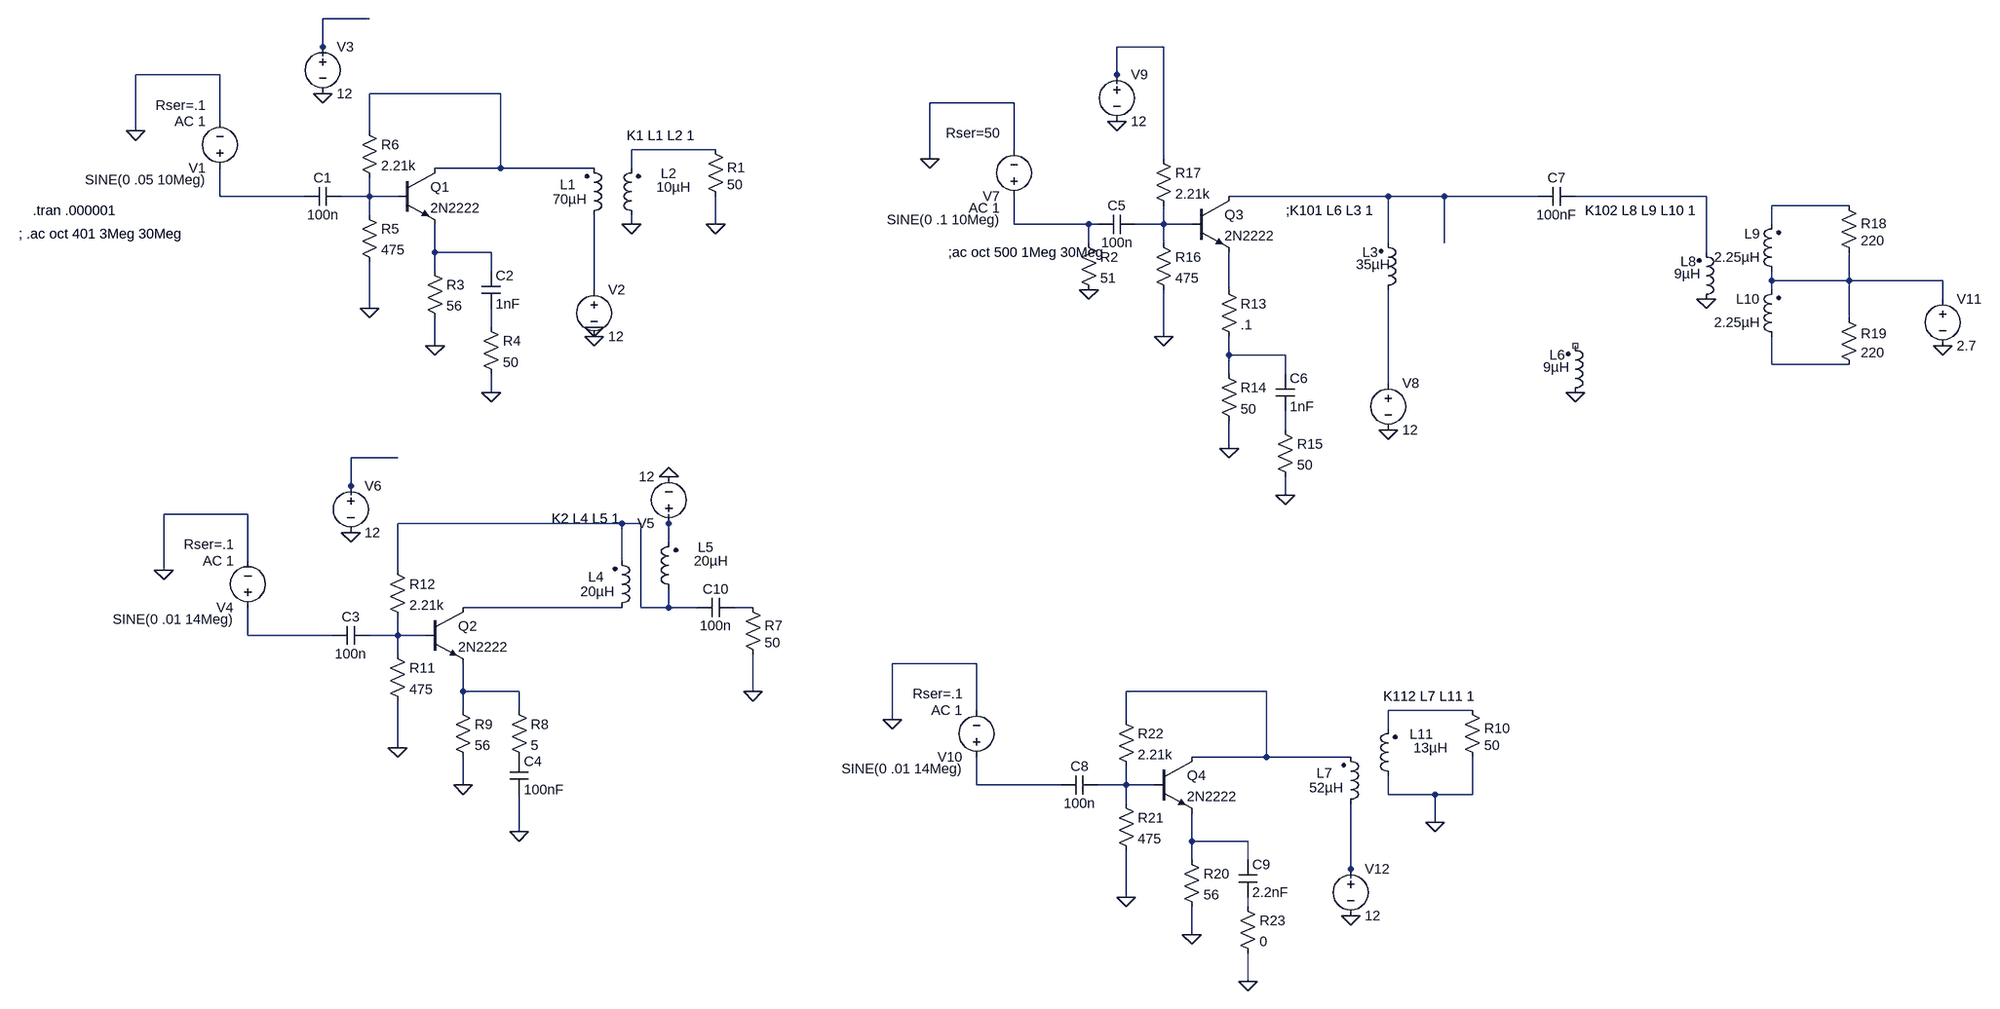
[diagram p0: schematic Tayloe-mix-amp.asc]
Tayloe-mix-amp.asc, the LTspice schematic file:
Version 4
SHEET 1 2732 1568
WIRE -112 -96 -192 -96
WIRE -192 -48 -192 -96
WIRE 1328 -48 1248 -48
WIRE -192 -32 -192 -48
WIRE -368 0 -512 0
WIRE 1248 0 1248 -48
WIRE 1248 16 1248 0
WIRE 112 32 -112 32
WIRE 1072 48 928 48
WIRE -368 80 -368 0
WIRE -512 96 -512 0
WIRE -112 96 -112 32
WIRE 480 128 336 128
WIRE 1072 128 1072 48
WIRE 928 144 928 48
WIRE 1328 144 1328 -48
WIRE 112 160 112 32
WIRE 112 160 0 160
WIRE 272 160 112 160
WIRE 336 160 336 128
WIRE -368 208 -368 160
WIRE -224 208 -368 208
WIRE -112 208 -112 176
WIRE -112 208 -160 208
WIRE -64 208 -112 208
WIRE 1712 208 1440 208
WIRE 1808 208 1712 208
WIRE 1968 208 1808 208
WIRE 2256 208 2032 208
WIRE 2512 224 2368 224
WIRE -112 240 -112 208
WIRE 336 256 336 240
WIRE 480 256 480 208
WIRE 1072 256 1072 208
WIRE 1200 256 1072 256
WIRE 1216 256 1200 256
WIRE 1328 256 1328 224
WIRE 1328 256 1280 256
WIRE 1376 256 1328 256
WIRE 2368 256 2368 224
WIRE 1200 288 1200 256
WIRE 1328 288 1328 256
WIRE 1712 288 1712 208
WIRE 1808 288 1808 208
WIRE 0 304 0 256
WIRE 96 304 0 304
WIRE 2256 304 2256 208
WIRE 0 336 0 304
WIRE 96 336 96 304
WIRE 2368 352 2368 336
WIRE 2512 352 2512 304
WIRE 2512 352 2368 352
WIRE 2672 352 2512 352
WIRE 272 368 272 240
WIRE 1440 368 1440 304
WIRE 2368 368 2368 352
WIRE 2672 384 2672 352
WIRE -112 400 -112 320
WIRE 2512 416 2512 352
WIRE 96 432 96 400
WIRE 1328 448 1328 368
WIRE 0 464 0 416
WIRE 1440 480 1440 448
WIRE 1536 480 1440 480
WIRE 2368 496 2368 448
WIRE 2512 496 2368 496
WIRE 1440 512 1440 480
WIRE 1536 512 1536 480
WIRE 1712 528 1712 368
WIRE 96 544 96 512
WIRE 1536 608 1536 576
WIRE 1440 640 1440 592
WIRE -64 656 -144 656
WIRE -144 704 -144 656
WIRE -144 720 -144 704
WIRE 1536 720 1536 688
WIRE -320 752 -464 752
WIRE 320 768 -64 768
WIRE 352 768 320 768
WIRE 400 768 400 752
WIRE 400 800 400 768
WIRE -320 832 -320 752
WIRE 320 832 320 768
WIRE -464 848 -464 752
WIRE -64 848 -64 768
WIRE 320 912 48 912
WIRE 352 912 352 768
WIRE 400 912 400 880
WIRE 400 912 352 912
WIRE 448 912 400 912
WIRE 544 912 512 912
WIRE -320 960 -320 912
WIRE -176 960 -320 960
WIRE -64 960 -64 928
WIRE -64 960 -112 960
WIRE -16 960 -64 960
WIRE -64 992 -64 960
WIRE 1008 1008 864 1008
WIRE 48 1056 48 1008
WIRE 144 1056 48 1056
WIRE 544 1056 544 992
WIRE 1504 1056 1264 1056
WIRE 48 1088 48 1056
WIRE 144 1088 144 1056
WIRE 1008 1088 1008 1008
WIRE 1856 1088 1712 1088
WIRE 864 1104 864 1008
WIRE 1264 1104 1264 1056
WIRE 1712 1120 1712 1088
WIRE -64 1152 -64 1072
WIRE 1504 1168 1504 1056
WIRE 1504 1168 1376 1168
WIRE 1648 1168 1504 1168
WIRE 48 1216 48 1168
WIRE 1008 1216 1008 1168
WIRE 1152 1216 1008 1216
WIRE 1264 1216 1264 1184
WIRE 1264 1216 1216 1216
WIRE 1312 1216 1264 1216
WIRE 1712 1232 1712 1200
WIRE 1792 1232 1712 1232
WIRE 1856 1232 1856 1168
WIRE 1856 1232 1792 1232
WIRE 1264 1248 1264 1216
WIRE 1792 1280 1792 1232
WIRE 144 1296 144 1232
WIRE 1376 1312 1376 1264
WIRE 1472 1312 1376 1312
WIRE 1376 1344 1376 1312
WIRE 1472 1344 1472 1312
WIRE 1648 1360 1648 1248
WIRE 1648 1376 1648 1360
WIRE 1264 1408 1264 1328
WIRE 1472 1424 1472 1408
WIRE 1376 1472 1376 1424
WIRE 1472 1552 1472 1504
FLAG -512 96 0
FLAG 272 432 0
FLAG 96 544 0
FLAG 0 464 0
FLAG -192 32 0
FLAG -112 400 0
FLAG -464 848 0
FLAG 400 688 0
FLAG 144 1296 0
FLAG 48 1216 0
FLAG -144 784 0
FLAG -64 1152 0
FLAG 544 1056 0
FLAG 336 256 0
FLAG 480 256 0
FLAG 928 144 0
FLAG 1536 720 0
FLAG 1440 640 0
FLAG 1248 80 0
FLAG 1328 448 0
FLAG 1712 608 0
FLAG 2672 464 0
FLAG 2032 544 0
FLAG 2256 384 0
FLAG 1200 368 0
FLAG 864 1104 0
FLAG 1648 1440 0
FLAG 1472 1552 0
FLAG 1376 1472 0
FLAG 1264 1408 0
FLAG 1792 1280 0
FLAG 272 448 0
SYMBOL ind2 256 256 M180
WINDOW 0 -42 68 Left 2
WINDOW 3 -55 43 Left 2
SYMATTR InstName L1
SYMATTR Value 70µH
SYMATTR Type ind
SYMBOL ind2 352 256 R180
WINDOW 0 -61 87 Left 2
WINDOW 3 -85 64 Left 2
SYMATTR InstName L2
SYMATTR Value 10µH
SYMATTR Type ind
SYMBOL res 464 112 R0
WINDOW 0 36 47 Left 2
SYMATTR InstName R1
SYMATTR Value 50
SYMBOL voltage -368 176 R180
WINDOW 123 24 96 Left 2
WINDOW 39 24 124 Left 2
WINDOW 3 24 -4 Left 2
SYMATTR Value2 AC 1
SYMATTR SpiceLine Rser=.1
SYMATTR Value SINE(0 .05 10Meg)
SYMATTR InstName V1
SYMBOL cap -160 192 R90
WINDOW 0 0 32 VBottom 2
WINDOW 3 32 32 VTop 2
SYMATTR InstName C1
SYMATTR Value 100n
SYMBOL npn -64 160 R0
SYMATTR InstName Q1
SYMATTR Value 2N2222
SYMBOL res -16 320 R0
SYMATTR InstName R3
SYMATTR Value 56
SYMBOL res 80 416 R0
SYMATTR InstName R4
SYMATTR Value 50
SYMBOL cap 80 336 R0
SYMATTR InstName C2
SYMATTR Value 1nF
SYMBOL res -128 224 R0
SYMATTR InstName R5
SYMATTR Value 475
SYMBOL res -128 80 R0
SYMATTR InstName R6
SYMATTR Value 2.21k
SYMBOL voltage -192 -64 R0
WINDOW 123 0 0 Left 0
WINDOW 39 0 0 Left 0
SYMATTR InstName V3
SYMATTR Value 12
SYMBOL ind2 304 928 M180
WINDOW 0 -42 68 Left 2
WINDOW 3 -55 43 Left 2
SYMATTR InstName L4
SYMATTR Value 20µH
SYMATTR Type ind
SYMBOL ind2 416 896 R180
WINDOW 0 -61 87 Left 2
WINDOW 3 -85 64 Left 2
SYMATTR InstName L5
SYMATTR Value 20µH
SYMATTR Type ind
SYMBOL res 528 896 R0
WINDOW 0 36 47 Left 2
SYMATTR InstName R7
SYMATTR Value 50
SYMBOL voltage -320 928 R180
WINDOW 123 24 96 Left 2
WINDOW 39 24 124 Left 2
WINDOW 3 24 -4 Left 2
SYMATTR Value2 AC 1
SYMATTR SpiceLine Rser=.1
SYMATTR Value SINE(0 .01 14Meg)
SYMATTR InstName V4
SYMBOL cap -112 944 R90
WINDOW 0 0 32 VBottom 2
WINDOW 3 32 32 VTop 2
SYMATTR InstName C3
SYMATTR Value 100n
SYMBOL npn -16 912 R0
SYMATTR InstName Q2
SYMATTR Value 2N2222
SYMBOL voltage 400 784 R180
WINDOW 123 0 0 Left 0
WINDOW 39 0 0 Left 0
SYMATTR InstName V5
SYMATTR Value 12
SYMBOL res 32 1072 R0
SYMATTR InstName R9
SYMATTR Value 56
SYMBOL cap 128 1168 R0
SYMATTR InstName C4
SYMATTR Value 100nF
SYMBOL res -80 976 R0
SYMATTR InstName R11
SYMATTR Value 475
SYMBOL res -80 832 R0
SYMATTR InstName R12
SYMATTR Value 2.21k
SYMBOL voltage -144 688 R0
WINDOW 123 0 0 Left 0
WINDOW 39 0 0 Left 0
SYMATTR InstName V6
SYMATTR Value 12
SYMBOL res 128 1072 R0
SYMATTR InstName R8
SYMATTR Value 5
SYMBOL ind2 1696 384 M180
WINDOW 0 -28 80 Left 2
WINDOW 3 -39 59 Left 2
SYMATTR InstName L3
SYMATTR Value 35µH
SYMATTR Type ind
SYMBOL voltage 1072 224 R180
WINDOW 123 24 -4 Left 2
WINDOW 39 24 124 Left 2
WINDOW 3 24 -24 Left 2
SYMATTR Value2 AC 1
SYMATTR SpiceLine Rser=50
SYMATTR Value SINE(0 .1 10Meg)
SYMATTR InstName V7
SYMBOL cap 1280 240 R90
WINDOW 0 0 32 VBottom 2
WINDOW 3 32 32 VTop 2
SYMATTR InstName C5
SYMATTR Value 100n
SYMBOL npn 1376 208 R0
SYMATTR InstName Q3
SYMATTR Value 2N2222
SYMBOL res 1424 496 R0
SYMATTR InstName R14
SYMATTR Value 50
SYMBOL res 1520 592 R0
SYMATTR InstName R15
SYMATTR Value 50
SYMBOL cap 1520 512 R0
SYMATTR InstName C6
SYMATTR Value 1nF
SYMBOL res 1312 272 R0
SYMATTR InstName R16
SYMATTR Value 475
SYMBOL res 1312 128 R0
SYMATTR InstName R17
SYMATTR Value 2.21k
SYMBOL voltage 1248 -16 R0
WINDOW 123 0 0 Left 0
WINDOW 39 0 0 Left 0
SYMATTR InstName V9
SYMATTR Value 12
SYMBOL voltage 1712 512 R0
WINDOW 123 0 0 Left 0
WINDOW 39 0 0 Left 0
SYMATTR InstName V8
SYMATTR Value 12
SYMBOL res 1424 352 R0
SYMATTR InstName R13
SYMATTR Value .1
SYMBOL ind2 2240 400 M180
WINDOW 0 -28 80 Left 2
WINDOW 3 -39 59 Left 2
SYMATTR InstName L8
SYMATTR Value 9µH
SYMATTR Type ind
SYMBOL ind2 2384 352 R180
WINDOW 0 36 80 Left 2
WINDOW 3 36 40 Left 2
SYMATTR InstName L9
SYMATTR Value 2.25µH
SYMATTR Type ind
SYMBOL ind2 2384 464 R180
WINDOW 0 36 80 Left 2
WINDOW 3 36 40 Left 2
SYMATTR InstName L10
SYMATTR Value 2.25µH
SYMATTR Type ind
SYMBOL res 2496 208 R0
WINDOW 0 36 47 Left 2
SYMATTR InstName R18
SYMATTR Value 220
SYMBOL res 2496 400 R0
WINDOW 0 36 43 Left 2
SYMATTR InstName R19
SYMATTR Value 220
SYMBOL voltage 2672 368 R0
WINDOW 123 0 0 Left 0
WINDOW 39 0 0 Left 0
SYMATTR InstName V11
SYMATTR Value 2.7
SYMBOL ind2 2016 560 M180
WINDOW 0 -28 80 Left 2
WINDOW 3 -39 59 Left 2
SYMATTR InstName L6
SYMATTR Value 9µH
SYMATTR Type ind
SYMBOL cap 2032 192 R90
WINDOW 0 0 32 VBottom 2
WINDOW 3 32 32 VTop 2
SYMATTR InstName C7
SYMATTR Value 100nF
SYMBOL res 1184 272 R0
SYMATTR InstName R2
SYMATTR Value 51
SYMBOL ind2 1632 1264 M180
WINDOW 0 -42 68 Left 2
WINDOW 3 -55 43 Left 2
SYMATTR InstName L7
SYMATTR Value 52µH
SYMATTR Type ind
SYMBOL ind2 1728 1216 R180
WINDOW 0 -61 87 Left 2
WINDOW 3 -85 64 Left 2
SYMATTR InstName L11
SYMATTR Value 13µH
SYMATTR Type ind
SYMBOL res 1840 1072 R0
WINDOW 0 36 47 Left 2
SYMATTR InstName R10
SYMATTR Value 50
SYMBOL voltage 1008 1184 R180
WINDOW 123 24 96 Left 2
WINDOW 39 24 124 Left 2
WINDOW 3 24 -4 Left 2
SYMATTR Value2 AC 1
SYMATTR SpiceLine Rser=.1
SYMATTR Value SINE(0 .01 14Meg)
SYMATTR InstName V10
SYMBOL cap 1216 1200 R90
WINDOW 0 0 32 VBottom 2
WINDOW 3 32 32 VTop 2
SYMATTR InstName C8
SYMATTR Value 100n
SYMBOL npn 1312 1168 R0
SYMATTR InstName Q4
SYMATTR Value 2N2222
SYMBOL voltage 1648 1344 R0
WINDOW 123 0 0 Left 0
WINDOW 39 0 0 Left 0
SYMATTR InstName V12
SYMATTR Value 12
SYMBOL res 1360 1328 R0
SYMATTR InstName R20
SYMATTR Value 56
SYMBOL cap 1456 1344 R0
SYMATTR InstName C9
SYMATTR Value 2.2nF
SYMBOL res 1248 1232 R0
SYMATTR InstName R21
SYMATTR Value 475
SYMBOL res 1248 1088 R0
SYMATTR InstName R22
SYMATTR Value 2.21k
SYMBOL res 1456 1408 R0
SYMATTR InstName R23
SYMATTR Value 0
SYMBOL cap 512 896 R90
WINDOW 0 0 32 VBottom 2
WINDOW 3 32 32 VTop 2
SYMATTR InstName C10
SYMATTR Value 100n
SYMBOL voltage 272 352 R0
WINDOW 123 0 0 Left 0
WINDOW 39 0 0 Left 0
SYMATTR InstName V2
SYMATTR Value 12
TEXT 328 104 Left 2 !K1 L1 L2 1
TEXT -712 272 Left 2 !; .ac oct 401 3Meg 30Meg
TEXT -688 232 Left 2 !.tran .000001
TEXT 200 760 Left 2 !K2 L4 L5 1
TEXT 1688 232 Right 2 !;K101 L6 L3 1
TEXT 2240 232 Right 2 !K102 L8 L9 L10 1
TEXT 960 304 Left 2 !;ac oct 500 1Meg 30Meg
TEXT 1704 1064 Left 2 !K112 L7 L11 1

The netlist it stands for:
* Tayloe-mix-amp.asc
L1 N014 N003 70µH
L2 0 N004 10µH
R1 N004 0 50
V1 N005 0 SINE(0 .05 10Meg) AC 1 Rser=.1
C1 N006 N005 100n
Q1 N003 N006 N012 0 2N2222
R3 N012 0 56
R4 N016 0 50
C2 N012 N016 1nF
R5 N006 0 475
R6 N003 N006 2.21k
V3 N001 0 12
L4 N024 N022 20µH
L5 N022 N023 20µH
R7 N025 0 50
V4 N026 0 SINE(0 .01 14Meg) AC 1 Rser=.1
C3 N027 N026 100n
Q2 N024 N027 N028 0 2N2222
V5 N023 0 12
R9 N028 0 56
C4 P001 0 100nF
R11 N027 0 475
R12 N022 N027 2.21k
V6 N021 0 12
R8 N028 P001 5
L3 N019 N007 35µH
V7 N010 0 SINE(0 .1 10Meg) AC 1 Rser=50
C5 N011 N010 100n
Q3 N007 N011 N015 0 2N2222
R14 N017 0 50
R15 N020 0 50
C6 N017 N020 1nF
R16 N011 0 475
R17 N002 N011 2.21k
V9 N002 0 12
V8 N019 0 12
R13 N015 N017 .1
L8 0 N008 9µH
L9 N013 N009 2.25µH
L10 N018 N013 2.25µH
R18 N009 N013 220
R19 N013 N018 220
V11 N013 0 2.7
L6 0 NC_01 9µH
C7 N008 N007 100nF
R2 N010 0 51
L7 N034 N029 52µH
L11 0 N030 13µH
R10 N030 0 50
V10 N031 0 SINE(0 .01 14Meg) AC 1 Rser=.1
C8 N032 N031 100n
Q4 N029 N032 N033 0 2N2222
V12 N034 0 12
R20 N033 0 56
C9 N033 N035 2.2nF
R21 N032 0 475
R22 N029 N032 2.21k
R23 N035 0 0
C10 N025 N022 100n
V2 N014 0 12
.model NPN NPN
.model PNP PNP
.lib standard.bjt
K1 L1 L2 1
; .ac oct 401 3Meg 30Meg
.tran .000001
K2 L4 L5 1
;K101 L6 L3 1
K102 L8 L9 L10 1
;ac oct 500 1Meg 30Meg
K112 L7 L11 1
.backanno
.end